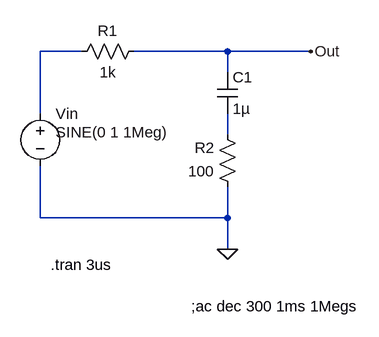
[diagram p0: schematic Q1.asc]
Q1.asc, the LTspice schematic file:
Version 4
SHEET 1 880 680
WIRE 80 48 16 48
WIRE 304 48 160 48
WIRE 432 48 304 48
WIRE 304 80 304 48
WIRE 16 144 16 48
WIRE 304 176 304 144
WIRE 16 304 16 224
WIRE 304 304 304 256
WIRE 304 304 16 304
WIRE 304 352 304 304
FLAG 304 352 0
FLAG 432 48 Out
SYMBOL res 176 32 R90
WINDOW 0 0 56 VBottom 2
WINDOW 3 32 56 VTop 2
SYMATTR InstName R1
SYMATTR Value 1k
SYMBOL res 320 272 R180
WINDOW 0 36 76 Left 2
WINDOW 3 36 40 Left 2
SYMATTR InstName R2
SYMATTR Value 100
SYMBOL cap 288 80 R0
SYMATTR InstName C1
SYMATTR Value 1µ
SYMBOL voltage 16 128 R0
WINDOW 123 24 124 Left 2
WINDOW 39 0 0 Left 0
WINDOW 3 24 44 Left 2
SYMATTR InstName Vin
SYMATTR Value SINE(0 1 1Meg)
TEXT 248 440 Left 2 !;ac dec 300 1ms 1Megs
TEXT 32 376 Left 2 !.tran 3us

The netlist it stands for:
* Q1.asc
R1 Out N001 1k
R2 0 N002 100
C1 Out N002 1µ
Vin N001 0 SINE(0 1 1Meg)
;ac dec 300 1ms 1Megs
.tran 3us
.backanno
.end